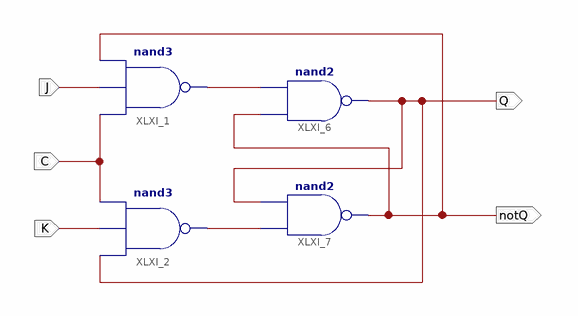
[diagram p0: schematic sheet 1]
// Xilinx ISE schematic scheme_pt2.sch (virtex5) as structural Verilog: 4 symbols, 5 ports
module scheme_pt2 (
  input  C,
  input  J,
  input  K,
  output notQ,
  output Q
);

  wire XLXN_14, XLXN_15;

  nand XLXI_1 (XLXN_14, C, J, notQ);
  nand XLXI_2 (XLXN_15, Q, K, C);
  nand XLXI_6 (Q, notQ, XLXN_14);
  nand XLXI_7 (notQ, XLXN_15, Q);
endmodule
